# Altium schematic sheet Vcc5V.SchDoc
size A
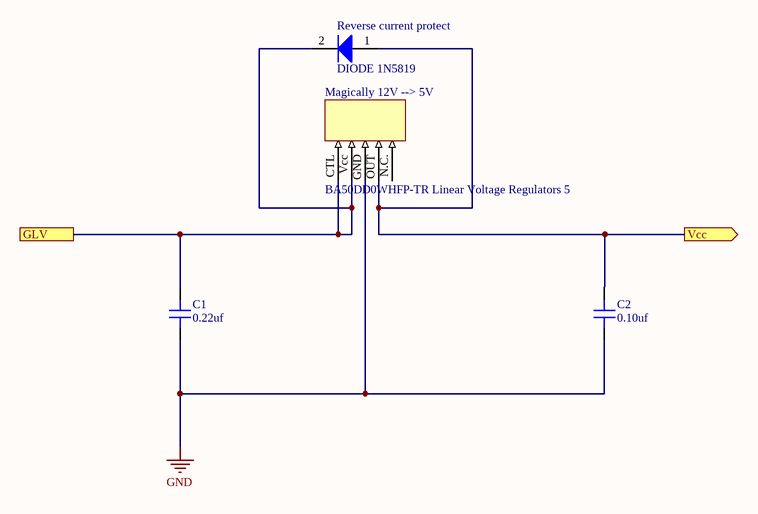
[diagram p0: Vcc5V.SchDoc]

## Parts
C1  value 0.22uf  [CAP 0402/1005]  (hidden comment: Capacitor MLCC 0.22uf 16V CAP 0402/1005)
C2  value 0.10uf  [CAP 0402/1005]  (hidden comment: Capacitor MLCC 0.10uf 16V CAP 0402/1005)
Magically_12V_-->_5V  BA50DD0WHFP-TR Linear Voltage Regulators 5  [HRP5]
Reverse_current_protect  DIODE 1N5819  [DIODE DO-214AC(SMA)]

## Ports
GLV, Vcc (out)

## Nets
GND: C1.1 C2.1 Magically_12V_-->_5V.GND
GLV: C1.2 Magically_12V_-->_5V.CTL Magically_12V_-->_5V.Vcc Reverse_current_protect.2(K) ; port GLV
Vcc: C2.2 Magically_12V_-->_5V.OUT Reverse_current_protect.1(A) ; port Vcc

Not connected (* = marked no-connect by the designer): Magically_12V_-->_5V N.C.

## Library data of the parts
C1 = 105: Manufacturer_id: 1; idCapacitor: 105; Name: Cap_0.22uf_16V_CAP 0402/1005; Dielectric: Ceramic; Created_By: Nick Mah; Drawer_id: 1; Voltage_Rating: 16V; Package: CAP 0402/1005; Created_Date: 10/20/2018
C2 = 103: Manufacturer_id: 1; idCapacitor: 103; Name: Cap_0.10uf_16V_CAP 0402/1005; Dielectric: Ceramic; Created_By: Nick Mah; Drawer_id: 1; Voltage_Rating: 16V; Package: CAP 0402/1005; Created_Date: 10/20/2018
Magically_12V_-->_5V = 6: Manufacturer_id: 1; idPMIC_Lin: 6; Name: BA50DD0WHFP-TR Linear Voltage Regulator 5; Value: 5V; Vin(Min): 3V; Vin(Max): 33V; Current_Rating: 2A; Dropout_Voltage: 0.7V; Drawer_id: 1; Vout(Max): 5V; Link: https://www.mouser.com/ProductDetail/ROHM-Semiconductor/BA50DD0WHFP-TR?qs=4kLU8WoGk0sFpKnESpdNFg%3D%3D
Reverse_current_protect = 2: Manufacturer_id: 1; idDiode: 2; Ic: 1A; Power: 40V; Drawer_id: 1; Name: 1N5819